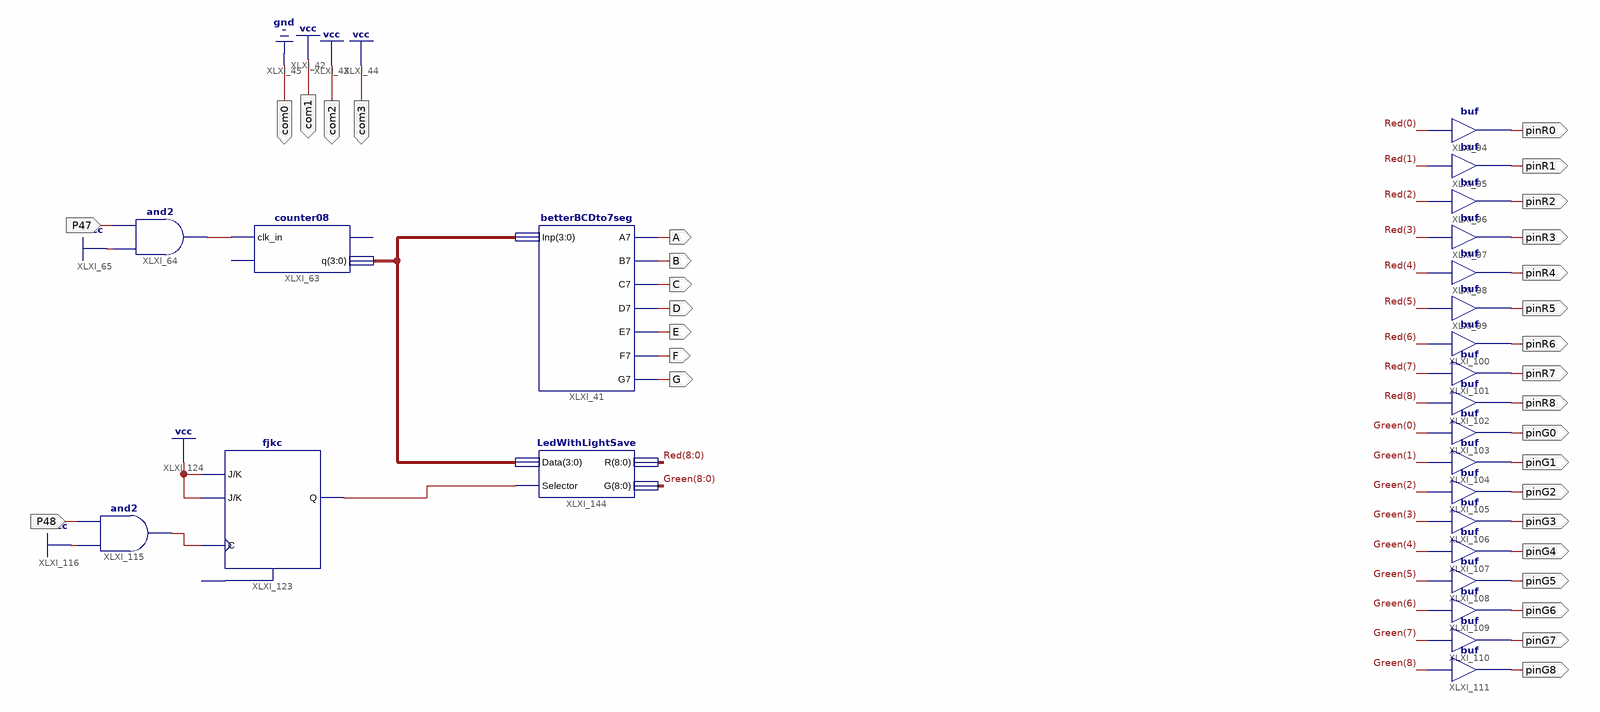
[diagram p0: schematic sheet 1]
// Xilinx ISE schematic main.sch (spartan6) as structural Verilog: 24 symbols, 31 ports
module main (
  input  P47,
  input  P48,
  output A,
  output B,
  output C,
  output D,
  output E,
  output F,
  output G,
  output com1,
  output com2,
  output com3,
  output com0,
  output pinR0,
  output pinR1,
  output pinR2,
  output pinR3,
  output pinR4,
  output pinR5,
  output pinR6,
  output pinR7,
  output pinR8,
  output pinG0,
  output pinG1,
  output pinG2,
  output pinG3,
  output pinG4,
  output pinG5,
  output pinG6,
  output pinG7,
  output pinG8
);

  wire XLXN_127, XLXN_215, XLXN_216;
  wire [3:0] XLXN_155;
  wire [8:0] Green, Red;

  counter08 XLXI_63 (.clk_in(XLXN_127), .q(XLXN_155));  // open: XLXN_14, divide_9
  and XLXI_64 (XLXN_127, 1'b1, P47);
  betterBCDto7seg XLXI_41 (.Inp(XLXN_155), .A7(A), .B7(B), .C7(C), .D7(D), .E7(E), .F7(F), .G7(G));
  and XLXI_115 (XLXN_215, 1'b1, P48);
  fjkc XLXI_123 (.C(XLXN_215), .J(1'b1), .K(1'b1), .Q(XLXN_216));  // open: CLR
  buf XLXI_95 (pinR1, Red[1]);
  buf XLXI_96 (pinR2, Red[2]);
  buf XLXI_97 (pinR3, Red[3]);
  buf XLXI_98 (pinR4, Red[4]);
  buf XLXI_99 (pinR5, Red[5]);
  buf XLXI_100 (pinR6, Red[6]);
  buf XLXI_101 (pinR7, Red[7]);
  buf XLXI_102 (pinR8, Red[8]);
  buf XLXI_103 (pinG0, Green[0]);
  buf XLXI_104 (pinG1, Green[1]);
  buf XLXI_105 (pinG2, Green[2]);
  buf XLXI_106 (pinG3, Green[3]);
  buf XLXI_107 (pinG4, Green[4]);
  buf XLXI_108 (pinG5, Green[5]);
  buf XLXI_109 (pinG6, Green[6]);
  buf XLXI_110 (pinG7, Green[7]);
  buf XLXI_111 (pinG8, Green[8]);
  buf XLXI_94 (pinR0, Red[0]);
  LedWithLightSave XLXI_144 (.Selector(XLXN_216), .Data(XLXN_155), .R(Red), .G(Green));

  assign com0 = 1'b0;
  assign com1 = 1'b1;
  assign com2 = 1'b1;
  assign com3 = 1'b1;
endmodule
